# EAGLE schematic ION-70 (EAGLE 6.5.0)
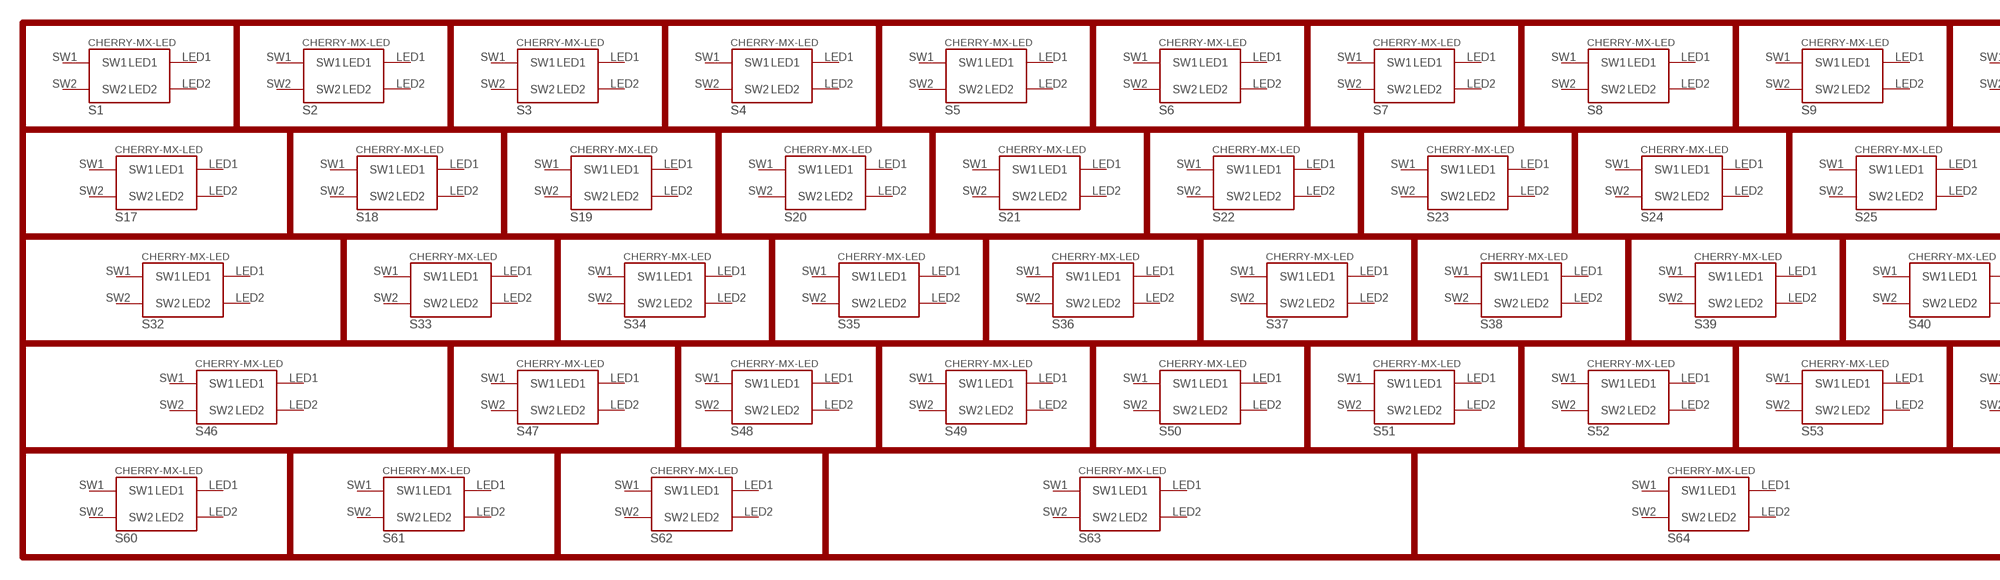
[diagram p0: schematic, sheet 1, part 1 of 2]
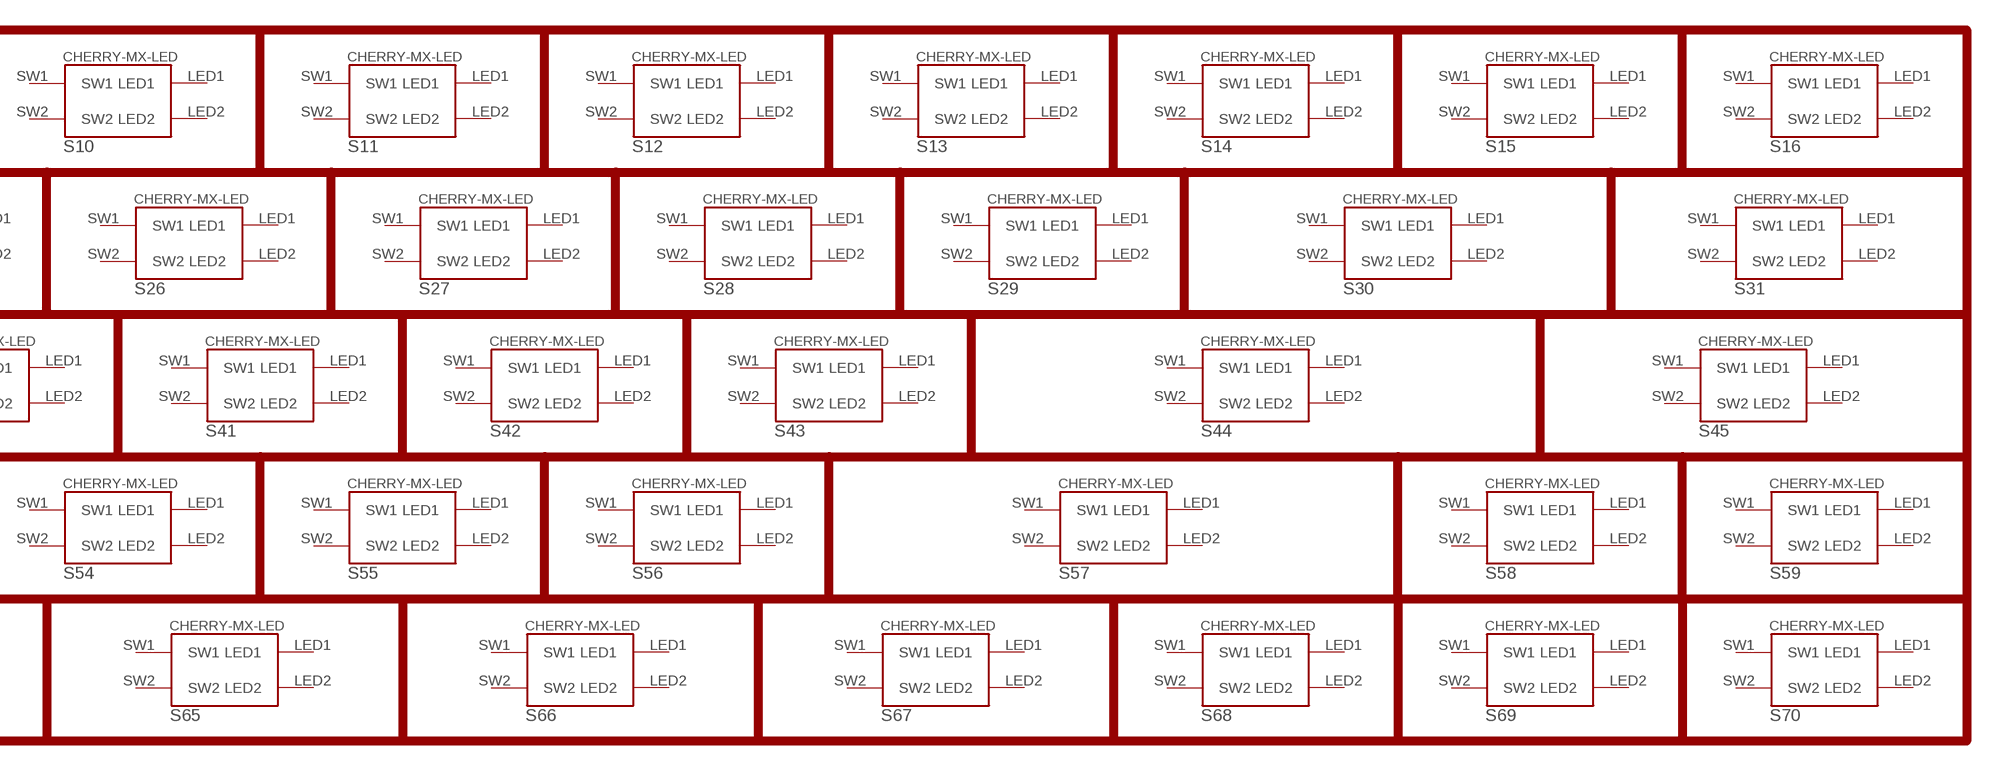
[diagram p1: schematic, sheet 1, part 2 of 2]

## Parts
S1  CHERRY-MX-LED1X1  [CHERRY-MX-LED-1X1]
S2  CHERRY-MX-LED1X1  [CHERRY-MX-LED-1X1]
S3  CHERRY-MX-LED1X1  [CHERRY-MX-LED-1X1]
S4  CHERRY-MX-LED1X1  [CHERRY-MX-LED-1X1]
S5  CHERRY-MX-LED1X1  [CHERRY-MX-LED-1X1]
S6  CHERRY-MX-LED1X1  [CHERRY-MX-LED-1X1]
S7  CHERRY-MX-LED1X1  [CHERRY-MX-LED-1X1]
S8  CHERRY-MX-LED1X1  [CHERRY-MX-LED-1X1]
S9  CHERRY-MX-LED1X1  [CHERRY-MX-LED-1X1]
S10  CHERRY-MX-LED1X1  [CHERRY-MX-LED-1X1]
S11  CHERRY-MX-LED1X1  [CHERRY-MX-LED-1X1]
S12  CHERRY-MX-LED1X1  [CHERRY-MX-LED-1X1]
S13  CHERRY-MX-LED1X1  [CHERRY-MX-LED-1X1]
S14  CHERRY-MX-LED1X1  [CHERRY-MX-LED-1X1]
S15  CHERRY-MX-LED1X1  [CHERRY-MX-LED-1X1]
S16  CHERRY-MX-LED1X1  [CHERRY-MX-LED-1X1]
S17  CHERRY-MX-LED1X1.25  [CHERRY-MX-LED-1X1.25]
S18  CHERRY-MX-LED1X1  [CHERRY-MX-LED-1X1]
S19  CHERRY-MX-LED1X1  [CHERRY-MX-LED-1X1]
S20  CHERRY-MX-LED1X1  [CHERRY-MX-LED-1X1]
S21  CHERRY-MX-LED1X1  [CHERRY-MX-LED-1X1]
S22  CHERRY-MX-LED1X1  [CHERRY-MX-LED-1X1]
S23  CHERRY-MX-LED1X1  [CHERRY-MX-LED-1X1]
S24  CHERRY-MX-LED1X1  [CHERRY-MX-LED-1X1]
S25  CHERRY-MX-LED1X1  [CHERRY-MX-LED-1X1]
S26  CHERRY-MX-LED1X1  [CHERRY-MX-LED-1X1]
S27  CHERRY-MX-LED1X1  [CHERRY-MX-LED-1X1]
S28  CHERRY-MX-LED1X1  [CHERRY-MX-LED-1X1]
S29  CHERRY-MX-LED1X1  [CHERRY-MX-LED-1X1]
S30  CHERRY-MX-LED1X1.5  [CHERRY-MX-LED-1X1.5]
S31  CHERRY-MX-LED1X1.25  [CHERRY-MX-LED-1X1.25]
S32  CHERRY-MX-LED1X1.5  [CHERRY-MX-LED-1X1.5]
S33  CHERRY-MX-LED1X1  [CHERRY-MX-LED-1X1]
S34  CHERRY-MX-LED1X1  [CHERRY-MX-LED-1X1]
S35  CHERRY-MX-LED1X1  [CHERRY-MX-LED-1X1]
S36  CHERRY-MX-LED1X1  [CHERRY-MX-LED-1X1]
S37  CHERRY-MX-LED1X1  [CHERRY-MX-LED-1X1]
S38  CHERRY-MX-LED1X1  [CHERRY-MX-LED-1X1]
S39  CHERRY-MX-LED1X1  [CHERRY-MX-LED-1X1]
S40  CHERRY-MX-LED1X1  [CHERRY-MX-LED-1X1]
S41  CHERRY-MX-LED1X1  [CHERRY-MX-LED-1X1]
S42  CHERRY-MX-LED1X1  [CHERRY-MX-LED-1X1]
S43  CHERRY-MX-LED1X1  [CHERRY-MX-LED-1X1]
S44  CHERRY-MX-LED1X2  [CHERRY-MX-LED-1X2]
S45  CHERRY-MX-LED1X1.5  [CHERRY-MX-LED-1X1.5]
S46  CHERRY-MX-LED1X2  [CHERRY-MX-LED-1X2]
S47  CHERRY-MX-LED1X1  [CHERRY-MX-LED-1X1]
S48  CHERRY-MX-LED1X1  [CHERRY-MX-LED-1X1]
S49  CHERRY-MX-LED1X1  [CHERRY-MX-LED-1X1]
S50  CHERRY-MX-LED1X1  [CHERRY-MX-LED-1X1]
S51  CHERRY-MX-LED1X1  [CHERRY-MX-LED-1X1]
S52  CHERRY-MX-LED1X1  [CHERRY-MX-LED-1X1]
S53  CHERRY-MX-LED1X1  [CHERRY-MX-LED-1X1]
S54  CHERRY-MX-LED1X1  [CHERRY-MX-LED-1X1]
S55  CHERRY-MX-LED1X1  [CHERRY-MX-LED-1X1]
S56  CHERRY-MX-LED1X1  [CHERRY-MX-LED-1X1]
S57  CHERRY-MX-LED1X2  [CHERRY-MX-LED-1X2]
S58  CHERRY-MX-LED1X1  [CHERRY-MX-LED-1X1]
S59  CHERRY-MX-LED1X1  [CHERRY-MX-LED-1X1]
S60  CHERRY-MX-LED1X1.25  [CHERRY-MX-LED-1X1.25]
S61  CHERRY-MX-LED1X1.25  [CHERRY-MX-LED-1X1.25]
S62  CHERRY-MX-LED1X1.25  [CHERRY-MX-LED-1X1.25]
S63  CHERRY-MX-LED1X2.75  [CHERRY-MX-LED-1X2.75]
S64  CHERRY-MX-LED1X2.75  [CHERRY-MX-LED-1X2.75]
S65  CHERRY-MX-LED1X1.25  [CHERRY-MX-LED-1X1.25]
S66  CHERRY-MX-LED1X1.25  [CHERRY-MX-LED-1X1.25]
S67  CHERRY-MX-LED1X1.25  [CHERRY-MX-LED-1X1.25]
S68  CHERRY-MX-LED1X1  [CHERRY-MX-LED-1X1]
S69  CHERRY-MX-LED1X1  [CHERRY-MX-LED-1X1]
S70  CHERRY-MX-LED1X1  [CHERRY-MX-LED-1X1]
Unconnected: S1.LED1 S1.LED2 S1.SW1 S1.SW2 S2.LED1 S2.LED2 S2.SW1 S2.SW2 S3.LED1 S3.LED2 S3.SW1 S3.SW2 S4.LED1 S4.LED2 S4.SW1 S4.SW2 S5.LED1 S5.LED2 S5.SW1 S5.SW2 S6.LED1 S6.LED2 S6.SW1 S6.SW2 S7.LED1 S7.LED2 S7.SW1 S7.SW2 S8.LED1 S8.LED2 S8.SW1 S8.SW2 S9.LED1 S9.LED2 S9.SW1 S9.SW2 S10.LED1 S10.LED2 S10.SW1 S10.SW2 S11.LED1 S11.LED2 S11.SW1 S11.SW2 S12.LED1 S12.LED2 S12.SW1 S12.SW2 S13.LED1 S13.LED2 S13.SW1 S13.SW2 S14.LED1 S14.LED2 S14.SW1 S14.SW2 S15.LED1 S15.LED2 S15.SW1 S15.SW2 S16.LED1 S16.LED2 S16.SW1 S16.SW2 S17.LED1 S17.LED2 S17.SW1 S17.SW2 S18.LED1 S18.LED2 S18.SW1 S18.SW2 S19.LED1 S19.LED2 S19.SW1 S19.SW2 S20.LED1 S20.LED2 S20.SW1 S20.SW2 S21.LED1 S21.LED2 S21.SW1 S21.SW2 S22.LED1 S22.LED2 S22.SW1 S22.SW2 S23.LED1 S23.LED2 S23.SW1 S23.SW2 S24.LED1 S24.LED2 S24.SW1 S24.SW2 S25.LED1 S25.LED2 S25.SW1 S25.SW2 S26.LED1 S26.LED2 S26.SW1 S26.SW2 S27.LED1 S27.LED2 S27.SW1 S27.SW2 S28.LED1 S28.LED2 S28.SW1 S28.SW2 S29.LED1 S29.LED2 S29.SW1 S29.SW2 S30.LED1 S30.LED2 S30.SW1 S30.SW2 S31.LED1 S31.LED2 S31.SW1 S31.SW2 S32.LED1 S32.LED2 S32.SW1 S32.SW2 S33.LED1 S33.LED2 S33.SW1 S33.SW2 S34.LED1 S34.LED2 S34.SW1 S34.SW2 S35.LED1 S35.LED2 S35.SW1 S35.SW2 S36.LED1 S36.LED2 S36.SW1 S36.SW2 S37.LED1 S37.LED2 S37.SW1 S37.SW2 S38.LED1 S38.LED2 S38.SW1 S38.SW2 S39.LED1 S39.LED2 S39.SW1 S39.SW2 S40.LED1 S40.LED2 S40.SW1 S40.SW2 S41.LED1 S41.LED2 S41.SW1 S41.SW2 S42.LED1 S42.LED2 S42.SW1 S42.SW2 S43.LED1 S43.LED2 S43.SW1 S43.SW2 S44.LED1 S44.LED2 S44.SW1 S44.SW2 S45.LED1 S45.LED2 S45.SW1 S45.SW2 S46.LED1 S46.LED2 S46.SW1 S46.SW2 S47.LED1 S47.LED2 S47.SW1 S47.SW2 S48.LED1 S48.LED2 S48.SW1 S48.SW2 S49.LED1 S49.LED2 S49.SW1 S49.SW2 S50.LED1 S50.LED2 S50.SW1 S50.SW2 S51.LED1 S51.LED2 S51.SW1 S51.SW2 S52.LED1 S52.LED2 S52.SW1 S52.SW2 S53.LED1 S53.LED2 S53.SW1 S53.SW2 S54.LED1 S54.LED2 S54.SW1 S54.SW2 S55.LED1 S55.LED2 S55.SW1 S55.SW2 S56.LED1 S56.LED2 S56.SW1 S56.SW2 S57.LED1 S57.LED2 S57.SW1 S57.SW2 S58.LED1 S58.LED2 S58.SW1 S58.SW2 S59.LED1 S59.LED2 S59.SW1 S59.SW2 S60.LED1 S60.LED2 S60.SW1 S60.SW2 S61.LED1 S61.LED2 S61.SW1 S61.SW2 S62.LED1 S62.LED2 S62.SW1 S62.SW2 S63.LED1 S63.LED2 S63.SW1 S63.SW2 S64.LED1 S64.LED2 S64.SW1 S64.SW2 S65.LED1 S65.LED2 S65.SW1 S65.SW2 S66.LED1 S66.LED2 S66.SW1 S66.SW2 S67.LED1 S67.LED2 S67.SW1 S67.SW2 S68.LED1 S68.LED2 S68.SW1 S68.SW2 S69.LED1 S69.LED2 S69.SW1 S69.SW2 S70.LED1 S70.LED2 S70.SW1 S70.SW2

## Library data of the parts
S1-S70 = Jordi:CHERRY-MX-LED: Cherry MX series keyswitch with LED